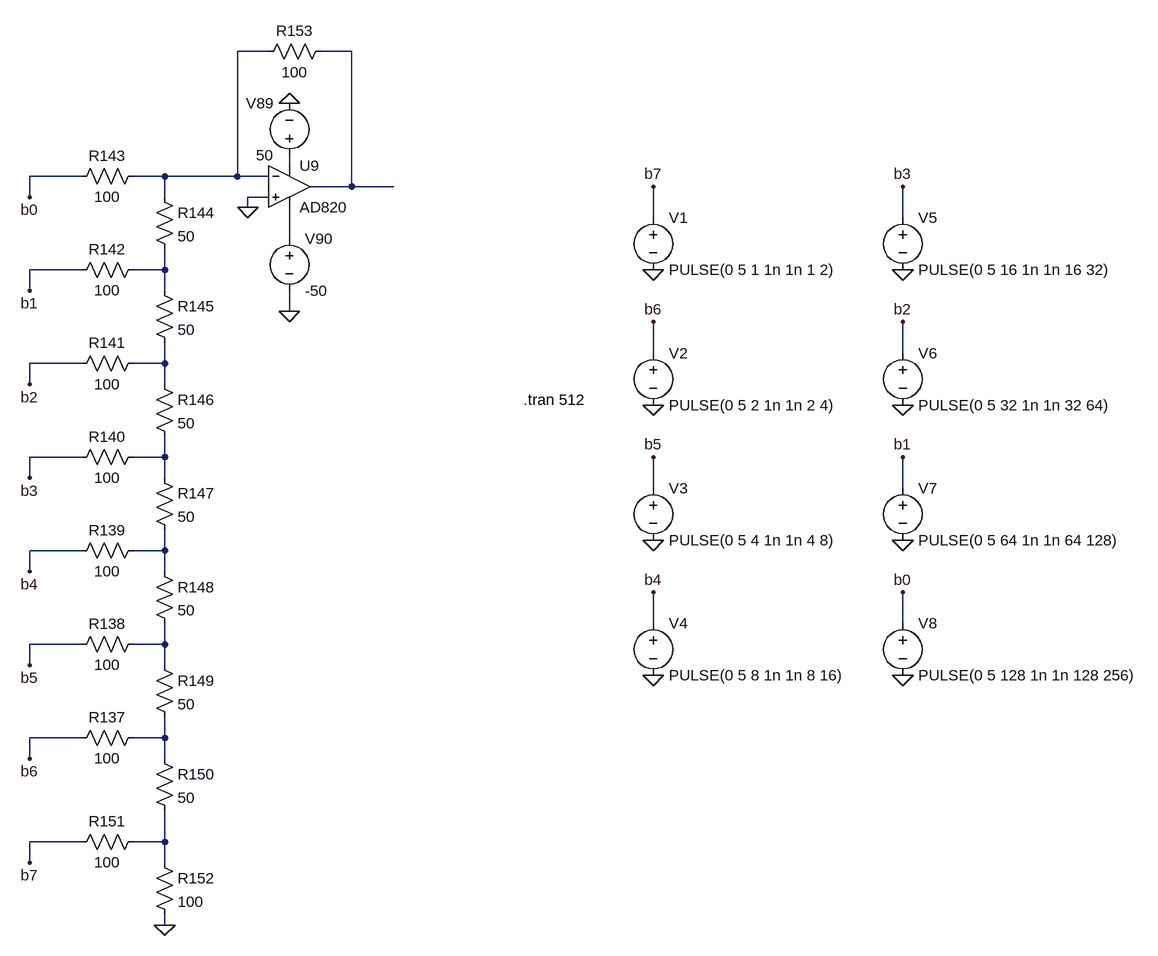
[diagram p0: schematic DAC PULSE TO SIN.asc]
DAC PULSE TO SIN.asc, the LTspice schematic file:
Version 4
SHEET 1 3492 2808
WIRE 464 -3232 416 -3232
WIRE 592 -3232 544 -3232
WIRE 496 -3056 496 -3072
WIRE 176 -3040 96 -3040
WIRE 304 -3040 256 -3040
WIRE 416 -3040 416 -3232
WIRE 416 -3040 304 -3040
WIRE 464 -3040 416 -3040
WIRE 592 -3024 592 -3232
WIRE 592 -3024 528 -3024
WIRE 656 -3024 592 -3024
WIRE 96 -3008 96 -3040
WIRE 304 -3008 304 -3040
WIRE 464 -3008 432 -3008
WIRE 432 -2992 432 -3008
WIRE 1056 -2976 1056 -3024
WIRE 1440 -2976 1440 -3024
WIRE 496 -2944 496 -2992
WIRE 176 -2896 96 -2896
WIRE 304 -2896 304 -2928
WIRE 304 -2896 256 -2896
WIRE 96 -2864 96 -2896
WIRE 304 -2864 304 -2896
WIRE 496 -2832 496 -2864
WIRE 1056 -2768 1056 -2816
WIRE 1440 -2768 1440 -2816
WIRE 176 -2752 96 -2752
WIRE 304 -2752 304 -2784
WIRE 304 -2752 256 -2752
WIRE 96 -2720 96 -2752
WIRE 304 -2720 304 -2752
WIRE 176 -2608 96 -2608
WIRE 304 -2608 304 -2640
WIRE 304 -2608 256 -2608
WIRE 96 -2576 96 -2608
WIRE 304 -2576 304 -2608
WIRE 1056 -2560 1056 -2608
WIRE 1440 -2560 1440 -2608
WIRE 176 -2464 96 -2464
WIRE 304 -2464 304 -2496
WIRE 304 -2464 256 -2464
WIRE 96 -2432 96 -2464
WIRE 304 -2432 304 -2464
WIRE 1056 -2352 1056 -2400
WIRE 1440 -2352 1440 -2400
WIRE 176 -2320 96 -2320
WIRE 304 -2320 304 -2352
WIRE 304 -2320 256 -2320
WIRE 96 -2288 96 -2320
WIRE 304 -2288 304 -2320
WIRE 176 -2176 96 -2176
WIRE 304 -2176 304 -2208
WIRE 304 -2176 256 -2176
WIRE 96 -2144 96 -2176
WIRE 304 -2144 304 -2176
WIRE 176 -2016 96 -2016
WIRE 304 -2016 304 -2064
WIRE 304 -2016 256 -2016
WIRE 96 -1984 96 -2016
WIRE 304 -1984 304 -2016
WIRE 304 -1888 304 -1904
FLAG 304 -1888 0
FLAG 432 -2992 0
FLAG 496 -3152 0
FLAG 496 -2832 0
FLAG 1056 -2896 0
FLAG 1056 -2688 0
FLAG 1056 -2480 0
FLAG 1056 -2272 0
FLAG 1440 -2896 0
FLAG 1440 -2688 0
FLAG 1440 -2480 0
FLAG 1440 -2272 0
FLAG 96 -1984 b7
FLAG 96 -2144 b6
FLAG 96 -2288 b5
FLAG 96 -2432 b4
FLAG 96 -2576 b3
FLAG 96 -2720 b2
FLAG 96 -2864 b1
FLAG 96 -3008 b0
FLAG 1056 -3024 b7
FLAG 1056 -2816 b6
FLAG 1056 -2608 b5
FLAG 1056 -2400 b4
FLAG 1440 -3024 b3
FLAG 1440 -2816 b2
FLAG 1440 -2608 b1
FLAG 1440 -2400 b0
SYMBOL res 272 -2192 R90
WINDOW 0 0 56 VBottom 2
WINDOW 3 32 56 VTop 2
SYMATTR InstName R137
SYMATTR Value 100
SYMBOL res 272 -2336 R90
WINDOW 0 0 56 VBottom 2
WINDOW 3 32 56 VTop 2
SYMATTR InstName R138
SYMATTR Value 100
SYMBOL res 272 -2480 R90
WINDOW 0 0 56 VBottom 2
WINDOW 3 32 56 VTop 2
SYMATTR InstName R139
SYMATTR Value 100
SYMBOL res 272 -2624 R90
WINDOW 0 0 56 VBottom 2
WINDOW 3 32 56 VTop 2
SYMATTR InstName R140
SYMATTR Value 100
SYMBOL res 272 -2768 R90
WINDOW 0 0 56 VBottom 2
WINDOW 3 32 56 VTop 2
SYMATTR InstName R141
SYMATTR Value 100
SYMBOL res 272 -2912 R90
WINDOW 0 0 56 VBottom 2
WINDOW 3 32 56 VTop 2
SYMATTR InstName R142
SYMATTR Value 100
SYMBOL res 272 -3056 R90
WINDOW 0 0 56 VBottom 2
WINDOW 3 32 56 VTop 2
SYMATTR InstName R143
SYMATTR Value 100
SYMBOL res 288 -3024 R0
SYMATTR InstName R144
SYMATTR Value 50
SYMBOL res 288 -2880 R0
SYMATTR InstName R145
SYMATTR Value 50
SYMBOL res 288 -2736 R0
SYMATTR InstName R146
SYMATTR Value 50
SYMBOL res 288 -2592 R0
SYMATTR InstName R147
SYMATTR Value 50
SYMBOL res 288 -2448 R0
SYMATTR InstName R148
SYMATTR Value 50
SYMBOL res 288 -2304 R0
SYMATTR InstName R149
SYMATTR Value 50
SYMBOL res 288 -2160 R0
SYMATTR InstName R150
SYMATTR Value 50
SYMBOL res 272 -2032 R90
WINDOW 0 0 56 VBottom 2
WINDOW 3 32 56 VTop 2
SYMATTR InstName R151
SYMATTR Value 100
SYMBOL res 288 -2000 R0
SYMATTR InstName R152
SYMATTR Value 100
SYMBOL OpAmps\\AD820 496 -3088 R0
SYMATTR InstName U9
SYMBOL res 560 -3248 R90
WINDOW 0 0 56 VBottom 2
WINDOW 3 32 56 VTop 2
SYMATTR InstName R153
SYMATTR Value 100
SYMBOL voltage 496 -3056 R180
WINDOW 0 24 96 Left 2
WINDOW 3 24 16 Left 2
WINDOW 123 0 0 Left 0
WINDOW 39 0 0 Left 0
SYMATTR InstName V89
SYMATTR Value 50
SYMBOL voltage 496 -2960 R0
WINDOW 123 0 0 Left 0
WINDOW 39 0 0 Left 0
SYMATTR InstName V90
SYMATTR Value -50
SYMBOL voltage 1056 -2992 R0
WINDOW 123 0 0 Left 0
WINDOW 39 0 0 Left 0
SYMATTR InstName V1
SYMATTR Value PULSE(0 5 1 1n 1n 1 2)
SYMBOL voltage 1056 -2784 R0
WINDOW 123 0 0 Left 0
WINDOW 39 0 0 Left 0
SYMATTR InstName V2
SYMATTR Value PULSE(0 5 2 1n 1n 2 4)
SYMBOL voltage 1056 -2576 R0
WINDOW 123 0 0 Left 0
WINDOW 39 0 0 Left 0
SYMATTR InstName V3
SYMATTR Value PULSE(0 5 4 1n 1n 4 8)
SYMBOL voltage 1056 -2368 R0
WINDOW 123 0 0 Left 0
WINDOW 39 0 0 Left 0
SYMATTR InstName V4
SYMATTR Value PULSE(0 5 8 1n 1n 8 16)
SYMBOL voltage 1440 -2992 R0
WINDOW 123 0 0 Left 0
WINDOW 39 0 0 Left 0
SYMATTR InstName V5
SYMATTR Value PULSE(0 5 16 1n 1n 16 32)
SYMBOL voltage 1440 -2784 R0
WINDOW 123 0 0 Left 0
WINDOW 39 0 0 Left 0
SYMATTR InstName V6
SYMATTR Value PULSE(0 5 32 1n 1n 32 64)
SYMBOL voltage 1440 -2576 R0
WINDOW 123 0 0 Left 0
WINDOW 39 0 0 Left 0
SYMATTR InstName V7
SYMATTR Value PULSE(0 5 64 1n 1n 64 128)
SYMBOL voltage 1440 -2368 R0
WINDOW 123 0 0 Left 0
WINDOW 39 0 0 Left 0
SYMATTR InstName V8
SYMATTR Value PULSE(0 5 128 1n 1n 128 256)
TEXT 856 -2696 Left 2 !.tran 512

The netlist it stands for:
* DAC PULSE TO SIN.asc
R137 N010 b6 100
R138 N009 b5 100
R139 N008 b4 100
R140 N007 b3 100
R141 N006 b2 100
R142 N005 b1 100
R143 N001 b0 100
R144 N001 N005 50
R145 N005 N006 50
R146 N006 N007 50
R147 N007 N008 50
R148 N008 N009 50
R149 N009 N010 50
R150 N010 N011 50
R151 N011 b7 100
R152 N011 0 100
XU9 0 N001 N003 N004 N002 AD820  ; pins In+ In- V+ V- OUT
R153 N002 N001 100
V89 N003 0 50
V90 N004 0 -50
V1 b7 0 PULSE(0 5 1 1n 1n 1 2)
V2 b6 0 PULSE(0 5 2 1n 1n 2 4)
V3 b5 0 PULSE(0 5 4 1n 1n 4 8)
V4 b4 0 PULSE(0 5 8 1n 1n 8 16)
V5 b3 0 PULSE(0 5 16 1n 1n 16 32)
V6 b2 0 PULSE(0 5 32 1n 1n 32 64)
V7 b1 0 PULSE(0 5 64 1n 1n 64 128)
V8 b0 0 PULSE(0 5 128 1n 1n 128 256)
.tran 512
.backanno
.end